# Altium schematic sheet PowerSwitch.SchDoc
size A4; DocumentNumber: 3; SheetNumber: 3; SheetTotal: 3
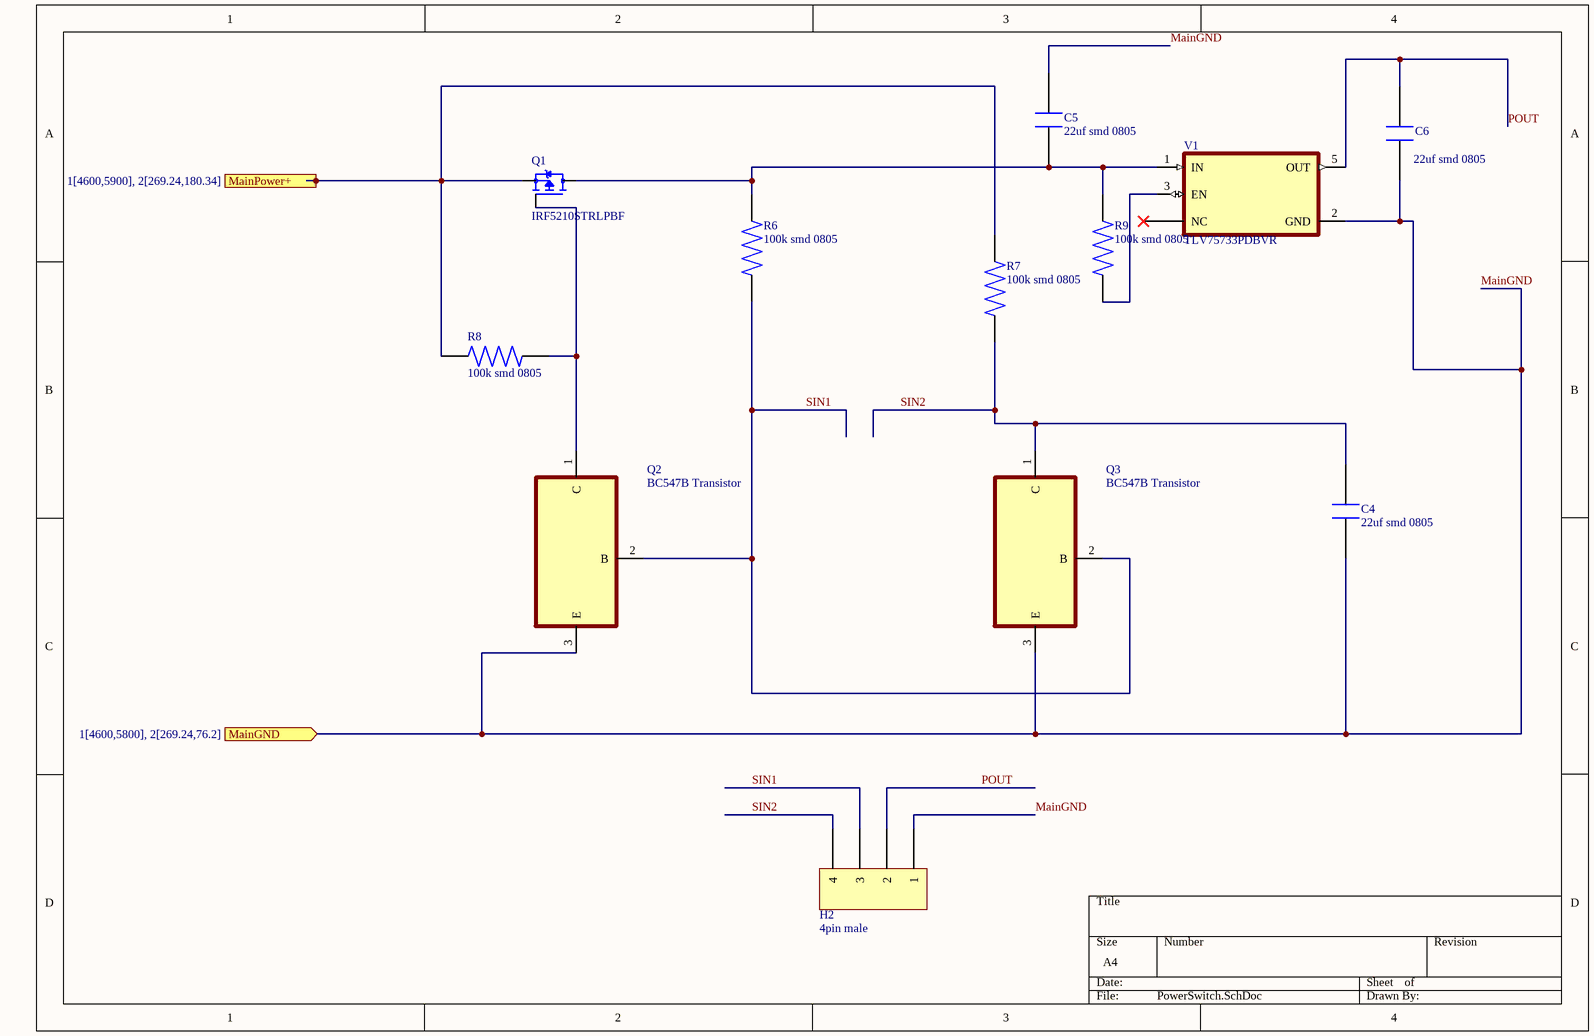
[diagram p0: PowerSwitch.SchDoc]

## Parts
C4  22uf smd 0805  [0805 SMD]
C5  22uf smd 0805  [0805 SMD]
C6  22uf smd 0805  [0805 SMD]
H2  4pin male  [4pin Header Male]
Q1  IRF5210STRLPBF  [TO254P1041X444X1930-3]
Q2  BC547B Transistor  [TO127P254X732-3]
Q3  BC547B Transistor  [TO127P254X732-3]
R6  100k smd 0805  [0805 SMD]
R7  100k smd 0805  [0805 SMD]
R8  100k smd 0805  [0805 SMD]
R9  100k smd 0805  [0805 SMD]
V1  TLV75733PDBVR  [SOT95P280X145-5N]

## Ports
MainGND (in, see 1[4600,5800], 2[269.24,76.2]), MainPower+ (in, see 1[4600,5900], 2[269.24,180.34])

## Nets
MainGND: C4.1 C5.2 C6.1 H2.1 Q2.3(E) Q3.3(E) V1.2(GND) ; port MainGND
MainPower+: Q1.2(S) R7.2 R8.1 ; port MainPower+
POUT: C6.2 H2.2 V1.5(OUT)
SIN1: H2.3 Q2.2(B) Q3.2(B) R6.1
SIN2: C4.2 H2.4 Q3.1(C) R7.1
NetC5_1: C5.1 Q1.3(D) R6.2 R9.1 V1.1(IN)
NetQ1_1: Q1.1(G) Q2.1(C) R8.2
NetR9_2: R9.2 V1.3(EN)

Not connected (* = marked no-connect by the designer): V1 4(NC)*

## Library data of the parts
C4-C6 = CL21A226KQCLRNC: Ceramic Capacitor, Multilayer, Ceramic, 6.3V, 10% +Tol, 10% -Tol, X5R, 15% TC, 22uF, Surface Mount, 0805; Manufacturer: Samsung; Multilayer: Yes; Supplier: Digikey; Supplier Part Number: 1276-6687-1-ND; Manufacturer Part Number: CL21A226KQCLRNC; RoHS: Yes; Category: Ceramic Capacitors; Stock: 1272424; Pricing: 1=0.13, 10=0.074, 100=0.0448, 1000=0.02986 (USD); Mounting Technology: Surface Mount; Pins: 2; Dielectric Material: Ceramic; Package Shape: Rectangular; Case/Package: 0805; Terminal Finish: Nickel; Min Operating Temperature: -55°C; Max Operating Temperature: 85°C; JESD-609 Code: e3; Value: 22uF; Capacitor Type: Ceramic; Tolerance  (fill in as +-): 10%; Packaging: Tape and Reel; Tolerance (fill in as +-): 10%; Rated DC Voltage (URdc): 6.3V; Temperature Characteristics Code: X5R; Termination: Wraparound; Reach SVHC Compliant: Yes; RoHS Compliant: Yes; ComponentLink1URL: https://datasheet.ciiva.com:443/pdfs/VipMasterIC/IC/SEMS/SEMS-S-A0008526420/SEMS-S-A0008526436-1.pdf?src-supplier=IHS+Markit; ComponentLink1Description: https://datasheet.ciiva.com:443/pdfs/VipMasterIC/IC/SEMS/SEMS-S-A0008526420/SEMS-S-A0008526436-1.pdf?src-supplier=IHS+Markit; ComponentLink2URL: http://www.samsungsem.com/kr/support/product-search/mlcc/CL21A226KQCLRNC.jsp?src-supplier=Digikey; ComponentLink2Description: http://www.samsungsem.com/kr/support/product-search/mlcc/CL21A226KQCLRNC.jsp?src-supplier=Digikey; ComponentLink3URL: https://datasheet.octopart.com/CL21A226KQCLRNC-Samsung-Electro-Mechanics-datasheet-110333968.pdf?src-supplier=Future+Electronics; ComponentLink3Description: https://datasheet.octopart.com/CL21A226KQCLRNC-Samsung-Electro-Mechanics-datasheet-110333968.pdf?src-supplier=Future+Electronics
H2 = 10129379-904002BLF: Conn Unshrouded Header HDR 4 POS 2.54mm Solder RA Thru-Hole Poly Bag; Manufacturer: Amphenol ICC / FCI; Supplier: Digikey; Supplier Part Number: 10129379-904002BLF-ND; Manufacturer Part Number: 10129379-904002BLF; RoHS: No; Category: Connectors; Stock: 19049; Pricing: 1=0.1, 10=0.087, 100=0.0739, 500=0.0659, 1000=0.06275, 5000=0.05601, 10000=0.05333 (USD)
Q1 = IRF5210STRLPBF: Power Field-Effect Transistor, 38A I(D), 100V, 0.06ohm, 1-Element, P-Channel, Silicon, Metal-oxide Semiconductor FET, TO-263AB; Manufacturer: Infineon; Package Body Material: Plastic; Avalanche Energy Rating (Eas): 120mJ; Case Connection: DRAIN; Drain-source On Resistance-Max: 60mR; Number of Elements: 1; Operating Mode: ENHANCEMENT MODE; Pulsed Drain Current-Max (IDM): 140A; Time @ Peak Reflow Temperature-Max (s): 30s; Transistor Application: SWITCHING; Power Dissipation-Max (Abs): 170W; Qualification Status: Not Qualified; Supplier: Mouser; Supplier Part Number: 942-IRF5210STRLPBF; Manufacturer Part Number: IRF5210STRLPBF; RoHS: Yes; Category: MOSFETs; Stock: 15276; Pricing: 1=3.59, 10=1.86, 50=1.82, 100=1.69, 1000=1.34, 10000=1.33 (USD); Pins: 2; Package Shape: Rectangular; Terminal Finish: Nickel; Transistor Element Material: SILICON; Max Operating Temperature: 150°C; JESD-609 Code: e3; Polarity/Channel Type: P-CHANNEL; Drain Current-Max (ID): 38A; DS Breakdown Voltage-Min: 100V; FET Technology: METAL-OXIDE SEMICONDUCTOR; JESD-30 Code: R-PSSO-G2; Moisture Sensitivity Level: 1; Package Style: SMALL OUTLINEMeter; Peak Reflow Temperature (Cel): 260°C; Surface Mount: Yes; Terminal Form: Gull Wing; Terminal Position: SINGLE; Drain Current-Max (Abs) (ID): 38A; JEDEC-95 Code: TO-263AB; RoHS Compliant: Yes; Reach SVHC Compliant: No; ComponentLink1URL: https://datasheet.ciiva.com:443/pdfs/VipMasterIC/IC/IRSD/IRSDS18784/IRSDS18784-1.pdf?src-supplier=IHS+Markit; ComponentLink1Description: https://datasheet.ciiva.com:443/pdfs/VipMasterIC/IC/IRSD/IRSDS18784/IRSDS18784-1.pdf?src-supplier=IHS+Markit
Q2 Q3 = BC547B: Small Signal Bipolar Transistor, 0.1A I(C), 45V V(BR)CEO, 1-Element, NPN, Silicon, TO-92; Manufacturer: ON Semiconductor / Fairchild; Supplier: Digikey; Supplier Part Number: BC547BFS-ND; Manufacturer Part Number: BC547B; RoHS: Yes; Category: BJTs; Stock: 2396; Pricing: 1=0.38, 10=0.234, 100=0.1472, 500=0.10944, 1000=0.09723, 2000=0.08693 (USD); RoHS Compliant: Yes
R6-R9 = RC0805FR-07100KL: Fixed Resistor, Metal Glaze/thick Film, 0.125W, 100000ohm, 150V, 1% +/-Tol, 100ppm/Cel, Surface Mount, 0805; Manufacturer: Yageo; Additional Feature: LASER TRIMMABLE; Power: 125mW; Rated Temperature: 70°C; Value: 100kR; Temperature Coefficient (ppm/Cel): 100; Package Height: 0.5mm; Package Length: 2mm; Package Width: 1.25mm; Supplier: Future Electronics; Supplier Part Number: 2952521; Manufacturer Part Number: RC0805FR-07100KL; RoHS: Yes; Category: Chip SMD Resistors; Stock: 1365000; Pricing: 5000=0.0016, 25000=0.0015, 100000=0.0015, 250000=0.0014, 625000=0.0014 (USD); Mounting Technology: Surface Mount; Pins: 2; Package Shape: Rectangular; Case/Package: 0805; Terminal Finish: Nickel; Min Operating Temperature: -55°C; Max Operating Temperature: 155°C; Tolerance: 1%; JESD-609 Code: e3; Termination: Wraparound; Resistor Type: FIXED RESISTOR; Construction: Chip; Packaging: Tape and Reel; Technology: METAL GLAZE/THICK FILM; Working Voltage: 150V; Reach SVHC Compliant: Yes; RoHS Compliant: Yes; ComponentLink1URL: https://datasheet.ciiva.com:443/pdfs/VipMasterIC/IC/YAGO/YAGO-S-A0008145938/YAGO-S-A0008145938-1.pdf?src-supplier=IHS+Markit; ComponentLink1Description: https://datasheet.ciiva.com:443/pdfs/VipMasterIC/IC/YAGO/YAGO-S-A0008145938/YAGO-S-A0008145938-1.pdf?src-supplier=IHS+Markit; ComponentLink2URL: https://datasheet.ciiva.com/11808/0900766b8106beab-11808858.pdf?src-supplier=Rs; ComponentLink2Description: https://datasheet.ciiva.com/11808/0900766b8106beab-11808858.pdf?src-supplier=Rs; ComponentLink3URL: https://datasheet.ciiva.com/2457/pyu-r-int-thick-7-2457018.pdf?src-supplier=Digikey; ComponentLink3Description: https://datasheet.ciiva.com/2457/pyu-r-int-thick-7-2457018.pdf?src-supplier=Digikey; ComponentLink4URL: https://datasheet.ciiva.com/2457/pyu-r-int-thick-7-2457019.pdf?src-supplier=Digikey; ComponentLink4Description: https://datasheet.ciiva.com/2457/pyu-r-int-thick-7-2457019.pdf?src-supplier=Digikey; ComponentLink5URL: https://datasheet.ciiva.com/2457/pyu-r-int-thick-7-2457017.pdf?src-supplier=Digikey; ComponentLink5Description: https://datasheet.ciiva.com/2457/pyu-r-int-thick-7-2457017.pdf?src-supplier=Digikey; ComponentLink6URL: https://datasheet.ciiva.com/12667/rc0805-12667001.pdf?src-supplier=Mouser; ComponentLink6Description: https://datasheet.ciiva.com/12667/rc0805-12667001.pdf?src-supplier=Mouser; ComponentLink7URL: https://datasheet.ciiva.com/7941/1697719-7941676.pdf?src-supplier=Element14; ComponentLink7Description: https://datasheet.ciiva.com/7941/1697719-7941676.pdf?src-supplier=Element14; ComponentLink8URL: https://datasheet.ciiva.com/7941/1686128-7941677.pdf?src-supplier=Element14; ComponentLink8Description: https://datasheet.ciiva.com/7941/1686128-7941677.pdf?src-supplier=Element14; ComponentLink9URL: https://datasheet.ciiva.com/7660/38627-7660796.pdf?src-supplier=Element14; ComponentLink9Description: https://datasheet.ciiva.com/7660/38627-7660796.pdf?src-supplier=Element14; ComponentLink10URL: https://datasheet.ciiva.com/22747/444164-22747534.pdf?src-supplier=Element14; ComponentLink10Description: https://datasheet.ciiva.com/22747/444164-22747534.pdf?src-supplier=Element14; ComponentLink11URL: https://datasheet.ciiva.com/7941/1697719-7941678.pdf?src-supplier=Element14; ComponentLink11Description: https://datasheet.ciiva.com/7941/1697719-7941678.pdf?src-supplier=Element14; ComponentLink12URL: https://datasheet.ciiva.com/16747/rc0805-16747226.pdf?src-supplier=Future+Electronics; ComponentLink12Description: https://datasheet.ciiva.com/16747/rc0805-16747226.pdf?src-supplier=Future+Electronics
V1 = TLV75733PDBVR: Fixed Positive LDO Regulator, 3.3V, 0.475V Dropout, PDSO5; Manufacturer: Texas Instruments; Regulator Type: FIXED POSITIVE SINGLE OUTPUT LDO REGULATOR; Supplier: Mouser; Supplier Part Number: 595-TLV75733PDBVR; Manufacturer Part Number: TLV75733PDBVR; RoHS: Yes; Category: Voltage Regulators - Linear; Stock: 11229; Pricing: 1=0.29, 10=0.196, 50=0.174, 100=0.15, 1000=0.125, 10000=0.11 (USD); Terminal Finish: Tin; JESD-609 Code: e3; Moisture Sensitivity Level: 1; Reach SVHC Compliant: Yes; RoHS Compliant: Yes; ComponentLink1URL: https://www.ti.com:443/lit/ds/symlink/tlv757p.pdf?src-supplier=IHS+Markit; ComponentLink1Description: https://www.ti.com:443/lit/ds/symlink/tlv757p.pdf?src-supplier=IHS+Markit; ComponentLink2URL: http://www.ti.com/lit/ds/symlink/tlv757p.pdf?src-supplier=Digikey; ComponentLink2Description: http://www.ti.com/lit/ds/symlink/tlv757p.pdf?src-supplier=Digikey